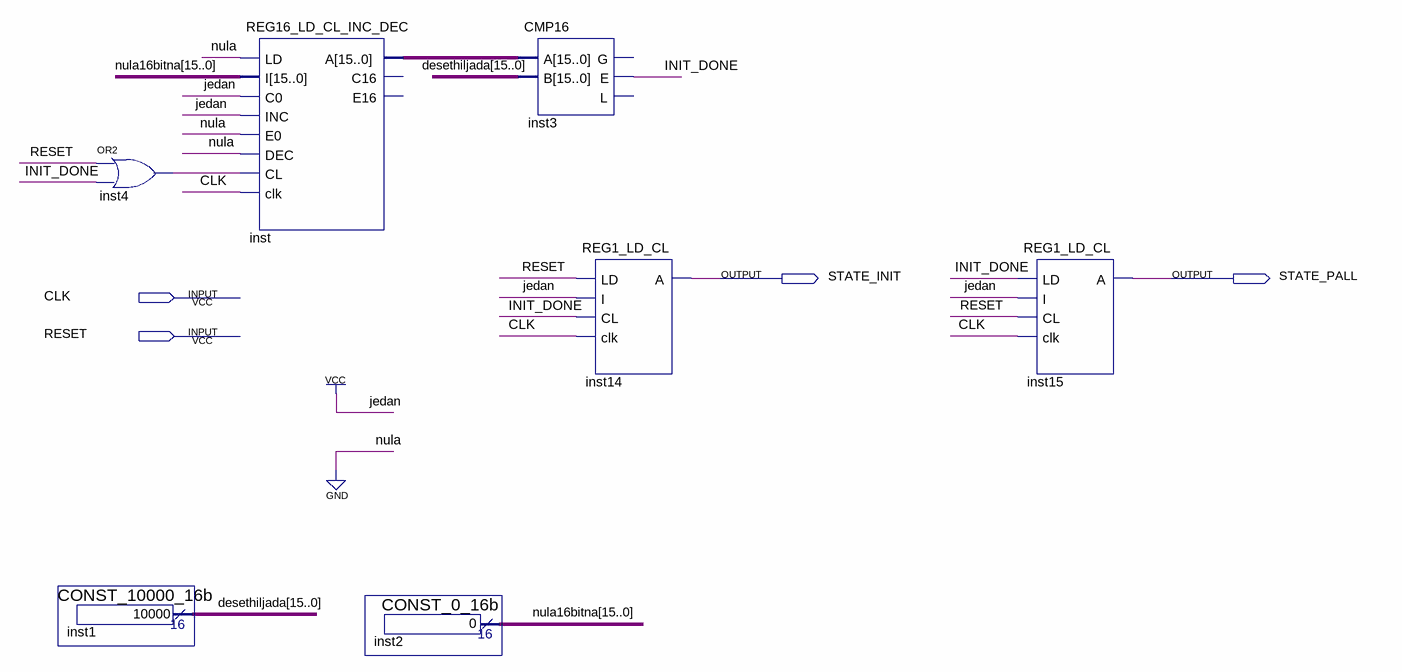
[diagram p0: schematic sheet]
// Quartus schematic sdram_controller.bdf as structural Verilog: 7 symbols, 4 pins
module sdram_controller (
  input  CLK,
  input  RESET,
  output STATE_INIT,
  output STATE_PALL
);

  wire INIT_DONE, inst4_out;
  wire [15:0] desethiljada, inst_a, nula16bitna;

  or inst4 (inst4_out, RESET, INIT_DONE);
  CONST_10000_16b inst1 (.result(desethiljada));
  REG16_LD_CL_INC_DEC inst (
    .LD(1'b0), .I(nula16bitna), .C0(1'b1), .INC(1'b1), .E0(1'b0), .DEC(1'b0), .CL(inst4_out), .clk(CLK),
    .A(inst_a));  // open: C16, E16
  CONST_0_16b inst2 (.result(nula16bitna));
  CMP16 inst3 (.A(inst_a), .B(desethiljada), .E(INIT_DONE));  // open: G, L
  REG1_LD_CL inst14 (.LD(RESET), .I(1'b1), .CL(INIT_DONE), .clk(CLK), .A(STATE_INIT));
  REG1_LD_CL inst15 (.LD(INIT_DONE), .I(1'b1), .CL(RESET), .clk(CLK), .A(STATE_PALL));
endmodule
